# Altium schematic sheet VALVEBOARD_ValveDrive4.SchDoc
size A3; SheetNumber: 7; SheetTotal: 7
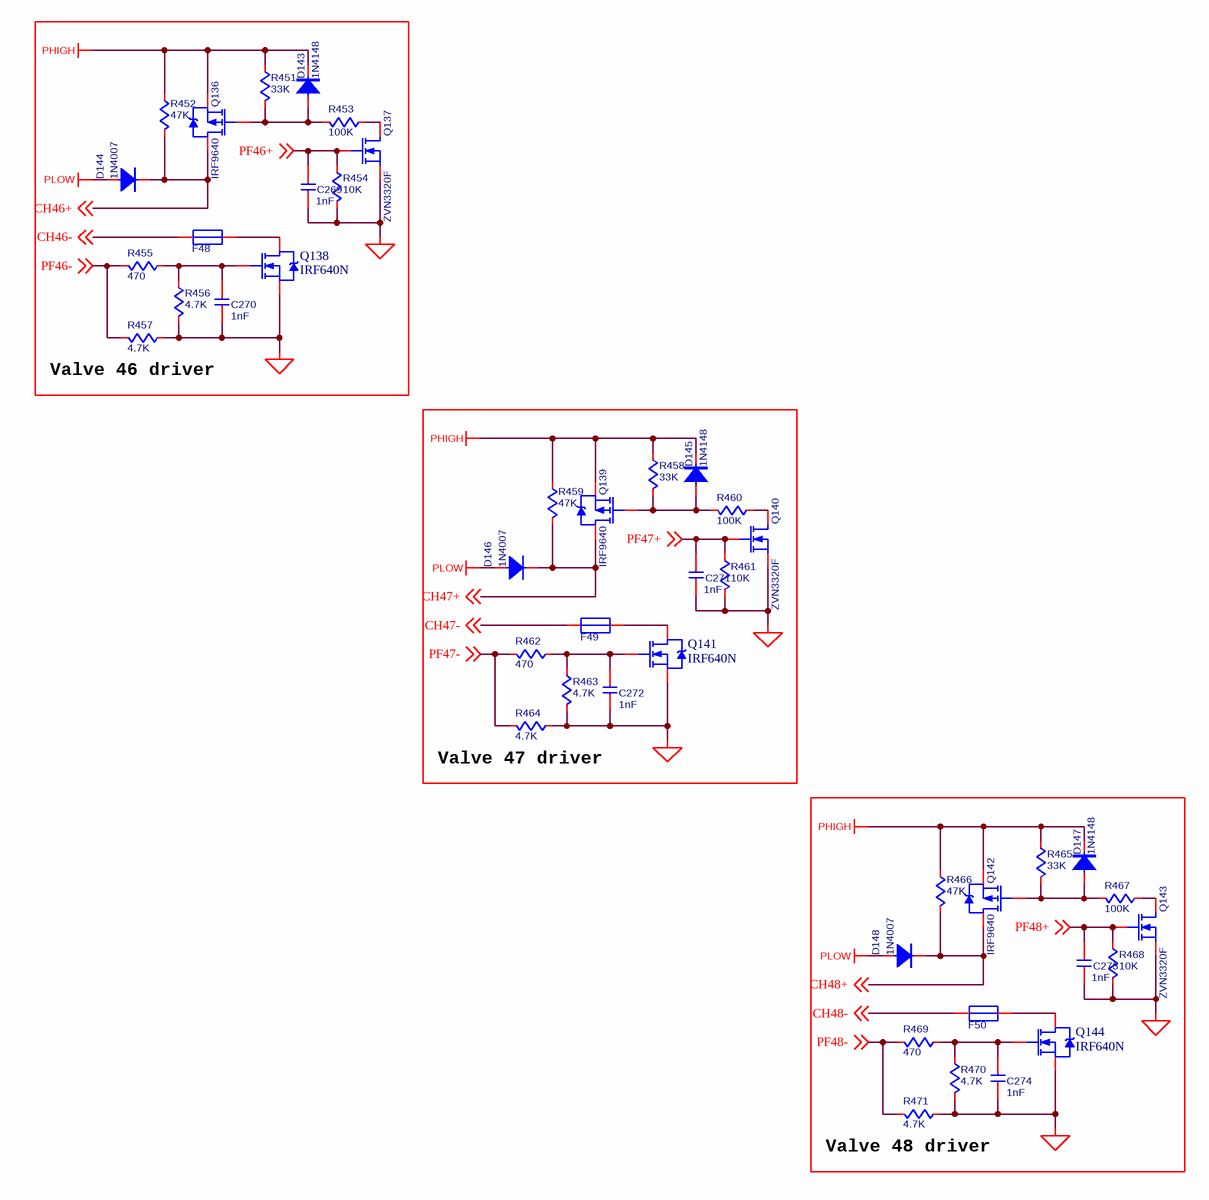
[diagram p0: VALVEBOARD_ValveDrive4.SchDoc]

## Parts
C269  value 1nF  [C0603]  (hidden comment: C-NOMO)
C270  value 1nF  [C0603]  (hidden comment: C-NOMO)
C271  value 1nF  [C0603]  (hidden comment: C-NOMO)
C272  value 1nF  [C0603]  (hidden comment: C-NOMO)
C273  value 1nF  [C0603]  (hidden comment: C-NOMO)
C274  value 1nF  [C0603]  (hidden comment: C-NOMO)
D143  1N4148  [SOD-123]
D144  1N4007  [1N4148]
D145  1N4148  [SOD-123]
D146  1N4007  [1N4148]
D147  1N4148  [SOD-123]
D148  1N4007  [1N4148]
F48  F50  [F-TH]  (value not drawn)
F49  F50  [F-TH]  (value not drawn)
F50  F50  [F-TH]  (value not drawn)
Q136  IRF9640  [TO-220AB]
Q137  ZVN3320F  [ZVN3320F]
Q138  IRF640N  [TO-220AB]
Q139  IRF9640  [TO-220AB]
Q140  ZVN3320F  [ZVN3320F]
Q141  IRF640N  [TO-220AB]
Q142  IRF9640  [TO-220AB]
Q143  ZVN3320F  [ZVN3320F]
Q144  IRF640N  [TO-220AB]
R451  value 33K  [R0603]  (hidden comment: R)
R452  value 47K  [R2512]  (hidden comment: R)
R453  value 100K  [R0603]  (hidden comment: R)
R454  value 10K  [R0603]  (hidden comment: R)
R455  value 470  [R0402]  (hidden comment: R)
R456  value 4.7K  [R0402]  (hidden comment: R)
R457  value 4.7K  [R0402]  (hidden comment: R)
R458  value 33K  [R0603]  (hidden comment: R)
R459  value 47K  [R2512]  (hidden comment: R)
R460  value 100K  [R0603]  (hidden comment: R)
R461  value 10K  [R0603]  (hidden comment: R)
R462  value 470  [R0402]  (hidden comment: R)
R463  value 4.7K  [R0402]  (hidden comment: R)
R464  value 4.7K  [R0402]  (hidden comment: R)
R465  value 33K  [R0603]  (hidden comment: R)
R466  value 47K  [R2512]  (hidden comment: R)
R467  value 100K  [R0603]  (hidden comment: R)
R468  value 10K  [R0603]  (hidden comment: R)
R469  value 470  [R0402]  (hidden comment: R)
R470  value 4.7K  [R0402]  (hidden comment: R)
R471  value 4.7K  [R0402]  (hidden comment: R)

## Blocks framed on the sheet
Valve 46 driver: C269 C270 D143 D144 F48 Q136-Q138 R451-R457
Valve 47 driver: C271 C272 D145 D146 F49 Q139-Q141 R458-R464
Valve 48 driver: C273 C274 D147 D148 F50 Q142-Q144 R465-R471

## Nets
PGND: C269.1 C270.1 C271.1 C272.1 C273.1 C274.1 Q137.3(S) Q138.3(S) Q140.3(S) Q141.3(S) Q143.3(S) Q144.3(S) R454.1 R456.1 R457.2 R461.1 R463.1 R464.2 R468.1 R470.1 R471.2
PHIGH: D143.1 D145.1 D147.1 Q136.3(S) Q139.3(S) Q142.3(S) R451.2 R452.2 R458.2 R459.2 R465.2 R466.2
PLOW: D144.2 D146.2 D148.2
CH46+: D144.1 Q136.2(D) R452.1 ; off-sheet CH46+
CH46-: F48.1 ; off-sheet CH46-
CH47+: D146.1 Q139.2(D) R459.1 ; off-sheet CH47+
CH47-: F49.1 ; off-sheet CH47-
CH48+: D148.1 Q142.2(D) R466.1 ; off-sheet CH48+
CH48-: F50.1 ; off-sheet CH48-
PF46+: C269.2 Q137.2(G) R454.2 ; off-sheet PF46+
PF46-: R455.1 R457.1 ; off-sheet PF46-
PF47+: C271.2 Q140.2(G) R461.2 ; off-sheet PF47+
PF47-: R462.1 R464.1 ; off-sheet PF47-
PF48+: C273.2 Q143.2(G) R468.2 ; off-sheet PF48+
PF48-: R469.1 R471.1 ; off-sheet PF48-
NetC270_2: C270.2 Q138.1(G) R455.2 R456.2
NetC272_2: C272.2 Q141.1(G) R462.2 R463.2
NetC274_2: C274.2 Q144.1(G) R469.2 R470.2
NetD143_2: D143.2 Q136.1(G) R451.1 R453.1
NetD145_2: D145.2 Q139.1(G) R458.1 R460.1
NetD147_2: D147.2 Q142.1(G) R465.1 R467.1
NetF48_2: F48.2 Q138.2(D)
NetF49_2: F49.2 Q141.2(D)
NetF50_2: F50.2 Q144.2(D)
NetQ137_1: Q137.1(D) R453.2
NetQ140_1: Q140.1(D) R460.2
NetQ143_1: Q143.1(D) R467.2

## Library data of the parts
C269-C274 = C-NOMO: voltage: 25V; precision: 5%
D143-D148 = DIOD1
Q136 Q139 Q142 = IRF9640: P-Channel Power MOSFET; Note: Pin 4 not drawn and electrically connected to Pin 2.; Published: 8-Jun-2000; LatestRevisionDate: 17-Jul-2002; LatestRevisionNote: Re-released for DXP Platform.; DatasheetVersion: PD-9.390D; PackageVersion: Feb-1997; PackageReference: TO-220AB; Publisher: Altium Limited; PackageDescription: TO, Thru-Hole, Vertical, Heatsink Mounted; 3 In-Line Leads; Pitch 2.54 mm; ComponentLink1Description: Manufacturer Link; ComponentLink1URL: http://www.irf.com/
Q137 Q140 Q143 = ZVN3320F: N-Channel MOSFET; Published: 8-Jun-2000; LatestRevisionDate: 17-Jul-2002; LatestRevisionNote: Re-released for DXP Platform.; PackageVersion: 1995/1996; PackageReference: E3; Publisher: Altium Limited; PackageDescription: TO, Flat Index; 3 In-Line, Axial Leads; Body Dia. 4.6mm; Lead Dia. 0.5 mm (max)
Q138 Q141 Q144 = IRF640N: N-Channel Power MOSFET; Note: Pin 2 is electrically connected to pin 4.; Published: 8-Jun-2000; LatestRevisionDate: 17-Jul-2002; LatestRevisionNote: Re-released for DXP Platform.; DatasheetVersion: PD-9.814; PackageVersion: Feb-1997; PackageReference: TO-220AB; Publisher: Altium Limited; PackageDescription: TO, Thru-Hole, Vertical, Heatsink Mounted; 3 In-Line Leads; Pitch 2.54 mm; ComponentLink1Description: Manufacturer Link; ComponentLink1URL: http://www.irf.com/
R451-R471 = R: precision: 1%